# EAGLE design PotBoard (EAGLE 6.2)
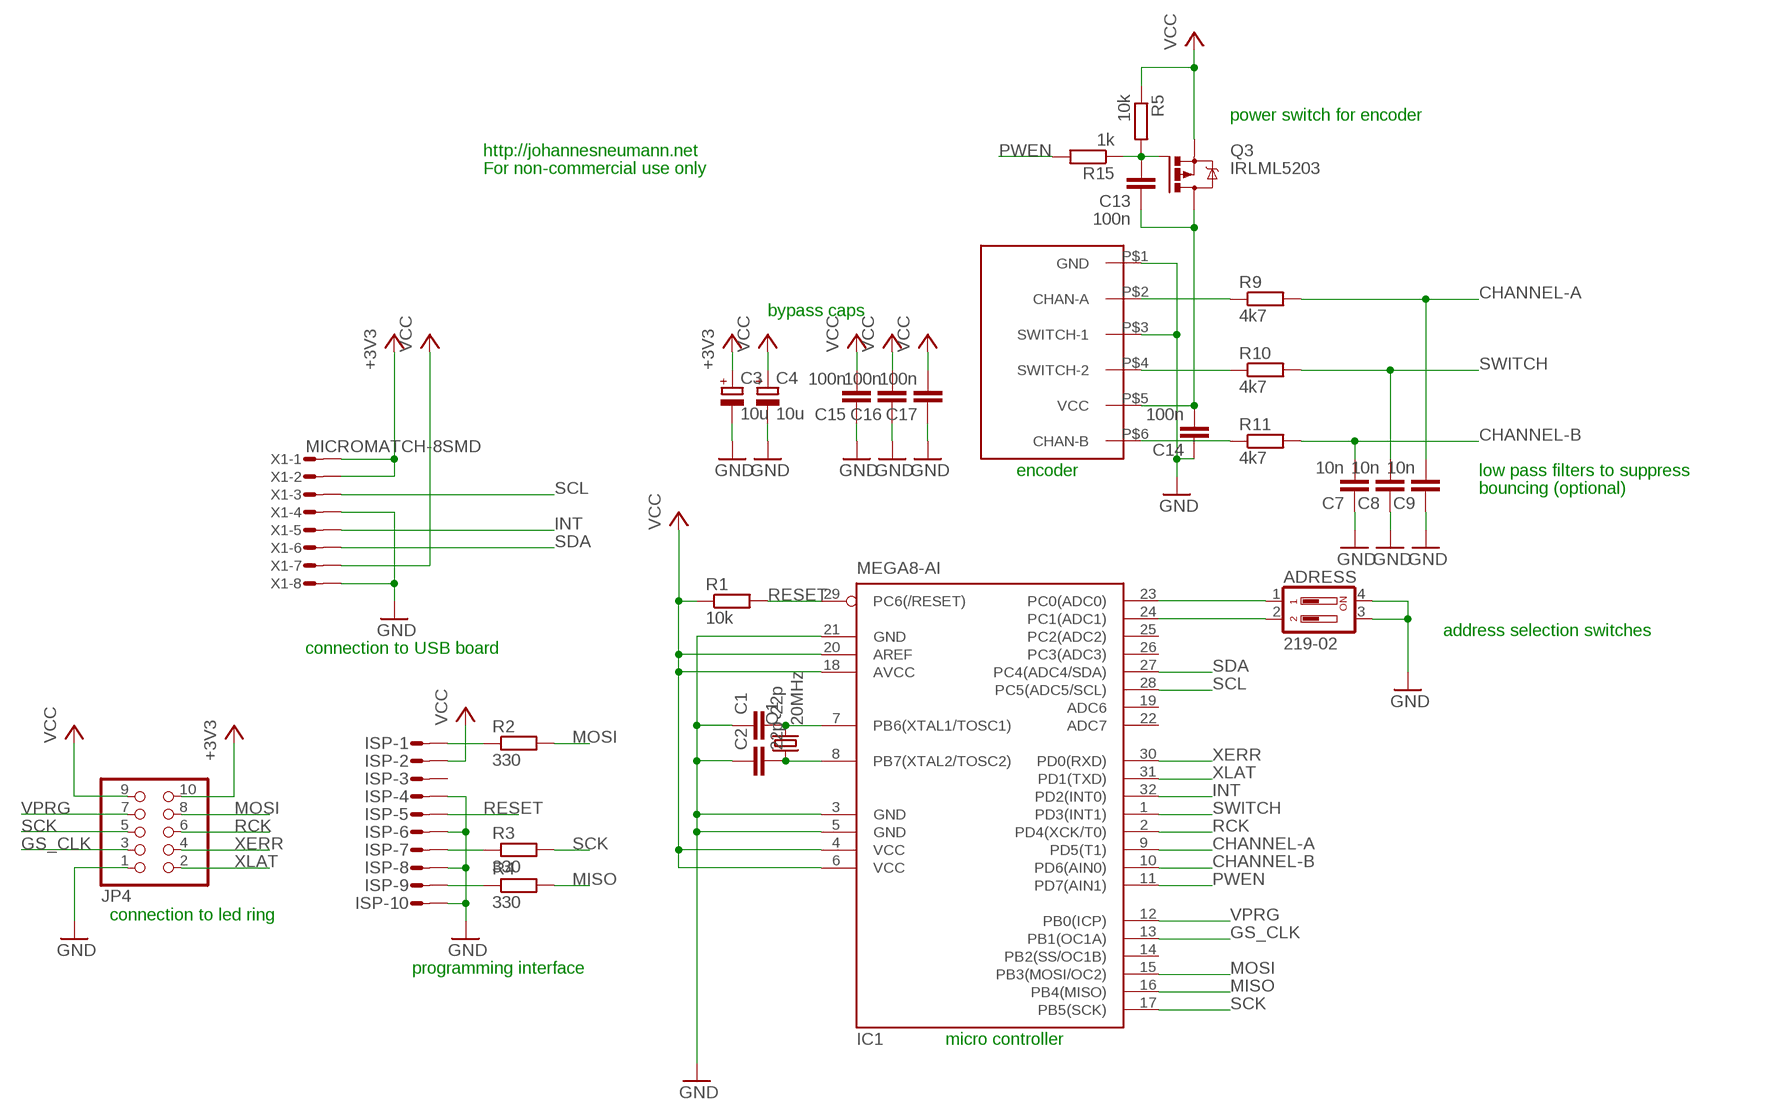
[diagram p0: schematic, sheet 1]

## Parts
ADRESS  219-02  [CTS-219-02]
C1  22p  C-EUC0603  [C0603]
C2  22p  C-EUC0603  [C0603]
C3  10u  CPOL-EU153CLV-0505  [153CLV-0505]
C4  10u  CPOL-EU153CLV-0505  [153CLV-0505]
C7  10n  C-EUC0603  [C0603]
C8  10n  C-EUC0603  [C0603]
C9  10n  C-EUC0603  [C0603]
C13  100n  C-EUC0603  [C0603]
C14  100n  C-EUC0603  [C0603]
C15  100n  C-EUC0603  [C0603]
C16  100n  C-EUC0603  [C0603]
C17  100n  C-EUC0603  [C0603]
IC1  MEGA8-AI  [TQFP32-08]
ISP  MICROMATCH-10-SMD  [MICROMATCH-10-SMD]
JP4  PINHD-2X5_2.54-SMD  [2X05SMD]
Q1  20MHz  CRYSTALSM49  [SM49]
Q3  IRLML5203  [MICRO3]
R1  10k  R-EU_R0603  [R0603]
R2  330  R-EU_R0603  [R0603]
R3  330  R-EU_R0603  [R0603]
R4  330  R-EU_R0603  [R0603]
R5  10k  R-EU_R0603  [R0603]
R9  4k7  R-EU_R0603  [R0603]
R10  4k7  R-EU_R0603  [R0603]
R11  4k7  R-EU_R0603  [R0603]
R15  1k  R-EU_R0603  [R0603]
U$1  BOURNS_EM14  [BOURNS_EM14_AXIAL]
X1  MICROMATCH-8SMD  [MICROMATCH-8-SMD]

## Nets
+3V3: C3.+ JP4.10 X1.1 X1.2
CHANNEL-A: C9.2 IC1.9(PD5(T1)) R9.2
CHANNEL-B: C7.2 IC1.10(PD6(AIN0)) R11.2
GND: ADRESS.3 ADRESS.4 C1.1 C2.1 C3.- C4.- C7.1 C8.1 C9.1 C14.1 C15.1 C16.1 C17.1 IC1.3(GND) IC1.5(GND) IC1.21(GND) ISP.P$4 ISP.P$6 ISP.P$8 ISP.P$10 JP4.1 U$1.P$1(GND) U$1.P$3(SWITCH-1) X1.4 X1.8
GS_CLK: IC1.13(PB1(OC1A)) JP4.3
INT: IC1.32(PD2(INT0)) X1.5
MISO: IC1.16(PB4(MISO)) R4.2
MOSI: IC1.15(PB3(MOSI/OC2)) JP4.8 R2.2
N$1: C1.2 IC1.7(PB6(XTAL1/TOSC1)) Q1.2
N$2: C2.2 IC1.8(PB7(XTAL2/TOSC2)) Q1.1
N$3: ISP.P$1 R2.1
N$4: ISP.P$7 R3.1
N$5: ISP.P$9 R4.1
N$6: ADRESS.1 IC1.23(PC0(ADC0))
N$20: ADRESS.2 IC1.24(PC1(ADC1))
N$26: R11.1 U$1.P$6(CHAN-B)
N$27: R10.1 U$1.P$4(SWITCH-2)
N$28: R9.1 U$1.P$2(CHAN-A)
N$31: C13.2 Q3.1(G) R5.2 R15.1
N$32: C13.1 C14.2 Q3.3(D) U$1.P$5(VCC)
PWEN: IC1.11(PD7(AIN1)) R15.2
RCK: IC1.2(PD4(XCK/T0)) JP4.6
RESET: IC1.29(PC6(/RESET)) ISP.P$5 R1.2
SCK: IC1.17(PB5(SCK)) JP4.5 R3.2
SCL: IC1.28(PC5(ADC5/SCL)) X1.3
SDA: IC1.27(PC4(ADC4/SDA)) X1.6
SWITCH: C8.2 IC1.1(PD3(INT1)) R10.2
VCC: C4.+ C15.2 C16.2 C17.2 IC1.4(VCC) IC1.6(VCC) IC1.18(AVCC) IC1.20(AREF) ISP.P$2 JP4.9 Q3.2(S) R1.1 R5.1 X1.7
VPRG: IC1.12(PB0(ICP)) JP4.7
XERR: IC1.30(PD0(RXD)) JP4.4
XLAT: IC1.31(PD1(TXD)) JP4.2
Unconnected: IC1.14(PB2(SS/OC1B)) IC1.19(ADC6) IC1.22(ADC7) IC1.25(PC2(ADC2)) IC1.26(PC3(ADC3)) ISP.P$3

## Notes on the sheet
- power switch for encoder
- http://johannesneumann.net
- For non-commercial use only
- bypass caps
- encoder | low pass filters to suppress
- bouncing (optional)
- address selection switches
- connection to USB board
- connection to led ring
- programming interface
- micro controller

## Library data of the parts
ADRESS = switch-dil:219-02*: Surface Mount DIP Switch Series 219 SMT CTS Electronic Components Sourc: www.ctscorp.com; OC_FARNELL: unknown; OC_NEWARK: unknown
C1 C2 C7-C9 C13-C17 = rcl:C-EU: CAPACITOR, European symbol
C3 C4 = rcl:CPOL-EU: POLARIZED CAPACITOR, European symbol
IC1 = atmel:MEGA8: MICROCONTROLLER 8 Kbytes FLASH, 1 kbytes SRAM, 512 bytes EEPROM, USART, 6-channel 10 bit ADC, 2-channel 8 bit ADC Pin compatible with Atmega48, ATMega88, ATMega168 Source: avr.lbr
ISP = con-amp-micromatch:MICROMATCH-10-SMD
JP4 = pinhead-2:PINHD-2X5: PIN HEADER
Q1 = crystal:CRYSTAL: CRYSTAL
Q3 = transistor-power:IRLML5203: HEXFET P-Channel Power MOSFET
R1-R5 R9-R11 R15 = rcl:R-EU_: RESISTOR, European symbol
U$1 = bourns_encoder:BOURNS_EM14: Bourns EM14 optical encoder
X1 = con-amp-micromatch-2:MICROMATCH-8: MicroMaTch 8 7-215464-8 / 0-215464-8 Drawing Number C-215464 DDEController.pdf

## Board
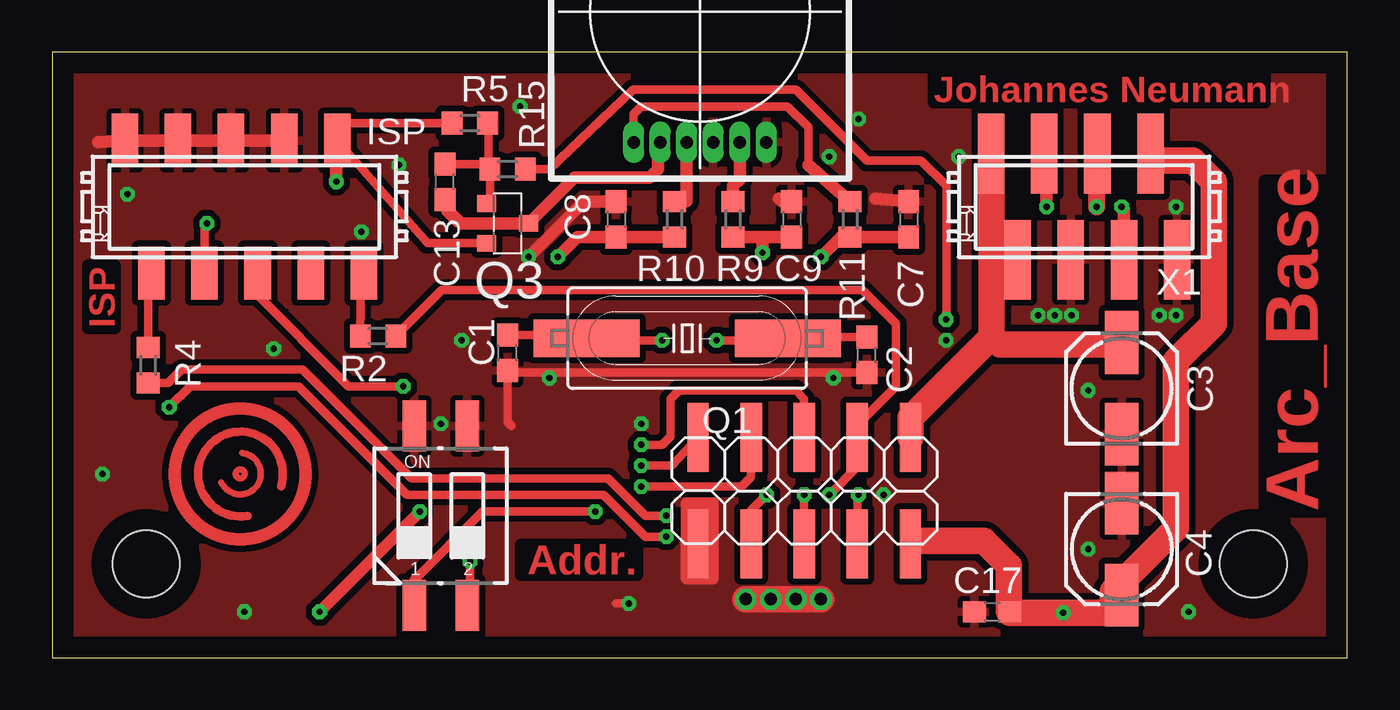
[diagram p1: board, top side]
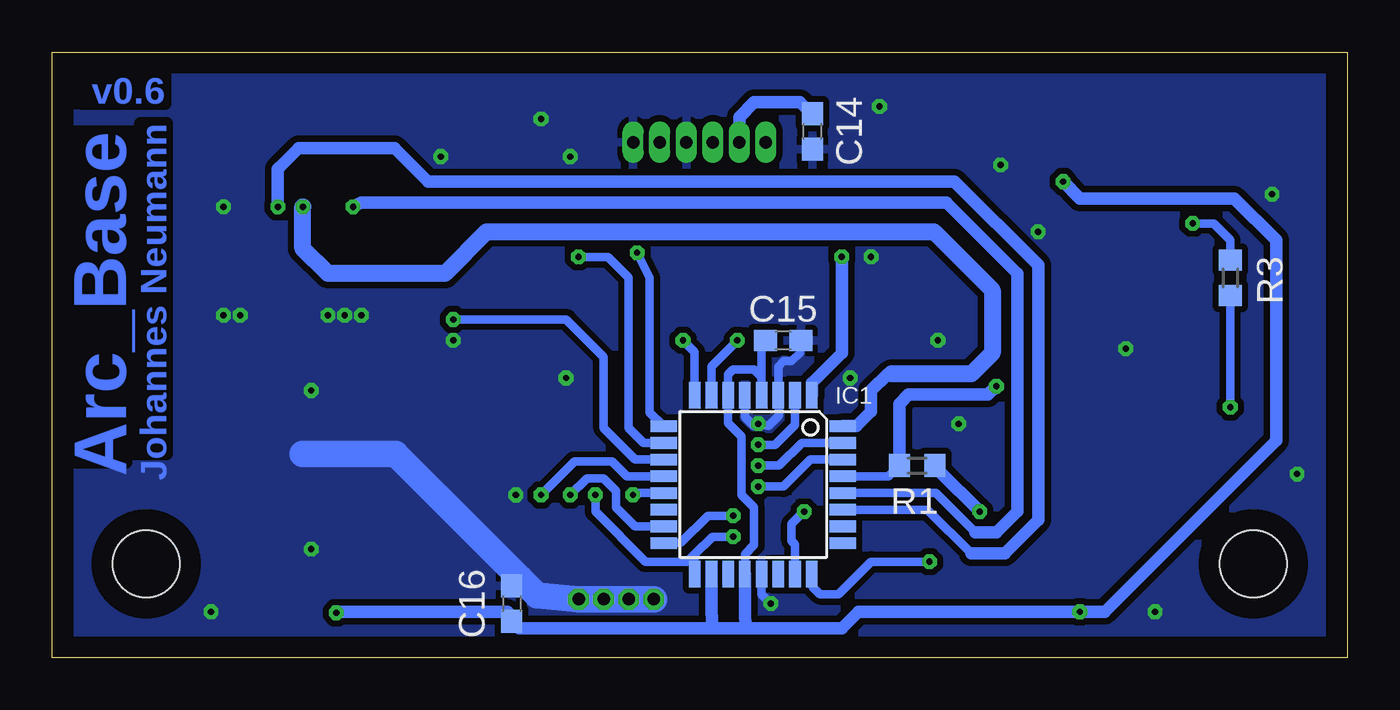
[diagram p2: board, bottom side, seen from below]

Size 62 x 29 mm. Coordinates in mm from the lower left corner, seen from the top.
Outline: 0,0 62,0 62,29 0,29 0,0
Copper layers (1*16): Top 0.035mm / dielectric 1.5mm / Bottom 0.035mm
Design rules "default": minimum track width 0.2mm, minimum drill 0.3mm, track to track 0.2mm, track to pad 0.2mm, pad to pad 0.2mm, via to via 0.2mm, smd to smd 0.15mm, copper to edge 40mil, drill to drill 8mil, minimum pad ring 0.2mm, minimum via ring 0.2mm, stop-mask expansion 0.15mm, vias tented up to drill 0.6mm, thermal gap 10mil
Holes 3.2 mm at 4.5,4.5 57.5,4.5

### Footprints (pad centres in the part's own frame; a part is rotated, then mirrored left to right if it is on the bottom)
CTS-219-02 = smd 1.13 x 2.44: 1 -1.27,-4.3; 2 1.27,-4.3; 3 1.27,4.3; 4 -1.27,4.3
C0603 = smd 1.1 x 1: 1 -0.85,0; 2 0.85,0
153CLV-0505 = smd 3 x 1.6: + 2.2,0; - -2.2,0
TQFP32-08 = smd 1.27 x 0.559: 1 -4.293,2.8; 2 -4.293,2; 3 -4.293,1.2; 4 -4.293,0.4; 5 -4.293,-0.4; 6 -4.293,-1.2; 7 -4.293,-2; 8 -4.293,-2.8; 17 4.293,-2.8; 18 4.293,-2; 19 4.293,-1.2; 20 4.293,-0.4; 21 4.293,0.4; 22 4.293,1.2; 23 4.293,2; 24 4.293,2.8 | smd 0.559 x 1.27: 9 -2.8,-4.293; 10 -2,-4.293; 11 -1.2,-4.293; 12 -0.4,-4.293; 13 0.4,-4.293; 14 1.2,-4.293; 15 2,-4.293; 16 2.8,-4.293; 25 2.8,4.293; 26 2,4.293; 27 1.2,4.293; 28 0.4,4.293; 29 -0.4,4.293; 30 -1.2,4.293; 31 -2,4.293; 32 -2.8,4.293
MICROMATCH-10-SMD = smd 1.27 x 2.54: P$1 -5.715,3.175; P$2 -4.445,-3.175; P$3 -3.175,3.175; P$4 -1.905,-3.175; P$5 -0.635,3.175; P$6 0.635,-3.175; P$7 1.905,3.175; P$8 3.175,-3.175; P$9 4.445,3.175; P$10 5.715,-3.175
2X05SMD = smd 1.016 x 3.302: 1 -5.08,-2.54; 2 -5.08,2.54; 3 -2.54,-2.54; 4 -2.54,2.54; 5 0,-2.54; 6 0,2.54; 7 2.54,-2.54; 8 2.54,2.54; 9 5.08,-2.54; 10 5.08,2.54
SM49 = smd 5.08 x 1.778: 1 -4.826,0; 2 4.826,0
MICRO3 = smd 0.8 x 0.9: 1 -0.95,-1; 2 0.95,-1; 3 0,1
R0603 = smd 1 x 1.1: 1 -0.85,0; 2 0.85,0
BOURNS_EM14_AXIAL = drill 0.6 pad 0.813 long: P$1 3.175,-6.25; P$2 1.905,-6.25; P$3 0.635,-6.25; P$4 -0.635,-6.25; P$5 -1.905,-6.25; P$6 -3.175,-6.25
MICROMATCH-8-SMD = smd 1.27 x 3.81: 1 4.445,-2.54; 2 3.175,2.54; 3 1.905,-2.54; 4 0.635,2.54; 5 -0.635,-2.54; 6 -1.905,2.54; 7 -3.175,-2.54; 8 -4.445,2.54

### Placement (x,y rotation side)
ADRESS  18.6,6.8 0 top
C1  21.8,14.6 90 top
C2  39,14.5 90 top
C3  51.2,12.9 90 top
C4  51.2,5.2 270 top
C7  41,21 270 top
C8  27,21 270 top
C9  35.4,21 270 top
C13  18.8,22.8 90 top
C14  25.6,25.2 90 bottom
C15  27,15.2 180 bottom
C16  40,2.6 270 bottom
C17  45,2.2 0 top
IC1  28.44,8.29 270 bottom
ISP  9.2,21.6 180 top
JP4  36,8 0 top
Q1  30.4,15.3 180 top
Q3  21.8,20.8 270 top
R1  20.6,9.2 180 bottom
R2  15.6,15.4 0 top
R3  5.6,18.2 270 bottom
R4  4.6,14 270 top
R5  20,25.6 0 top
R9  32.6,21 270 top
R10  29.8,21 270 top
R11  38.2,21 270 top
R15  21.8,23.4 0 top
U$1  31.01,30.94 0 top
X1  49.4,21.6 180 top

### Tracks (layer width: path | path; a pad name or v marks a point on that pad's centre or on a via)
+3V3
  Top 0.406: C3.+ 51.25,15.1 51,14.85
  Top 1.27: 44.95,21.6 X1.1 44.95,19.2 | 44.95,19.2 44.95,15.36 | 51,14.85 51.33,14.85 | X1.2 45.09,19.06 44.95,19.2 | JP4.10 41.08,11.48 44.95,15.36 | 44.95,15.36 45.05,15.36 45.4,15 51.1,15 C3.+
CHANNEL-A  (via drill 0.3)
  Top 0.61: R9.2 34,20.15 | 34,20.15 C9.2 | v34,19.4 34,20.15
  Bottom 0.406: v34,19.4 33.4,18.2 33.4,11.76 IC1.9
CHANNEL-B  (via drill 0.3)
  Top 0.61: C7.2 R11.2 37.75,20.15 v36.8,19.2
  Bottom 0.406: v36.8,19.2 35.4,19.2 34.4,18.2 34.4,11 33.69,10.29 IC1.10
GND  (via drill 0.3, 0.6)
  Top 0.406: 22,11.1 21.8,11.3 C1.1 22.1,13.65 C2.1 | v27.6,2.6 27,2.6
  Top 0.61: 34.95,21.85 34.8,22 C9.1 | C7.1 39.4,22 | 2.2,24.69 ISP.P$10 ISP.P$8 ISP.P$6 ISP.P$4 | C8.1 25.45,21.85 v22.8,19.2 | 30.4,4.6 30.4,7.4 31.6,7.4 31.6,3.8 30.4,3.8 30.4,4.6 | JP4.1 30.92,5.12 30.4,4.6
  Top 1.27: v34.4,2.8 v35.6,2.8 v36.8,2.8 v33.2,2.8
  Bottom 0.406: IC1.5 28.84,11.54 28.4,11.1 v28.2,11.2 27.7,11.1 27.2,11.6 27.2,12.54 IC1.3 27.24,13.96 27,14.2 26.6,14.2 26.2,14.6 26.2,15.15 C15.1 | C16.1 39.95,3.45 39.6,3.8 | IC1.21 28.04,3.04 v27.6,2.6
  Bottom 1.27: v33.2,2.8 v34.4,2.8 v35.6,2.8 v36.8,2.8 38.8,3 39.6,3.8 45.57,9.77 50,9.77
  other vias: 18.6,11.2 54.4,2.2 42.8,15.2 37.4,13.4 14.8,20.4 22.4,26.4 3.6,22.2 9.2,2.2 2.4,8.8 39.8,7.8 38.6,25.8 49.6,12.8 49.6,5.2 37.2,24 16.6,23.6 19.6,15.2 23.8,13.4 10.6,14.8 43.4,24 48.8,16.4 53.8,16.4 53.8,21.6 48,16.4 47.2,16.4 53,16.4
  pour Top (isolate 0.305): 0,28.6 62,28.6 62,0 0,0
  pour Bottom (isolate 0.305): 0,28.6 62,28.6 62,0 0,0
GS_CLK  (via drill 0.3)
  Top 0.406: JP4.3 33.46,7.06 v34.2,7.8
  Bottom 0.406: IC1.13 34.11,7.89 v34.2,7.8
INT  (via drill 0.3)
  Top 0.813: v50,21.6 50,24.11 X1.5
  Bottom 0.61: IC1.32 23.51,11.09 22.8,11.8 22.8,12.8 22,13.6 21.8,13.6 19.2,13.6
  Bottom 0.813: 21.8,13.6 18,13.6 17,14.6 17,17.6 19.8,20.4 41.2,20.4 43.2,18.4 48.8,18.4 50,19.6 v50,21.6
MISO  (via drill 0.3)
  Top 0.406: R4.2 5.55,13.15 6.2,13.8 12,13.8 17.2,8.6 26.6,8.6 28.4,6.8 v29.4,6.8
  Bottom 0.406: IC1.16 31.91,5.49 30.6,6.8 v29.4,6.8
MOSI  (via drill 0.3)
  Top 0.406: R2.2 18.65,17.6 38.8,17.6 40.4,16 40.4,13 38.6,11.2 38.6,10.5 JP4.8 38.6,10.38 38.6,9.2 v37.2,7.8
  Bottom 0.406: IC1.15 34.09,6.29 35,7.2 35,8 35.6,8.6 36.4,8.6 v37.2,7.8
N$1  (via drill 0.3)
  Top 0.406: v29.2,15.2 25.67,15.2 25.82,15.45 | C1.2 25.82,15.45 | 25.82,15.45 Q1.2
  Bottom 0.406: IC1.7 30.44,13.96 v29.2,15.2
N$2  (via drill 0.3)
  Top 0.406: v31.8,15.2 35.13,15.2 Q1.1 35.33,15.2 35.8,15.2 35.85,15.35 C2.2
  Bottom 0.406: IC1.8 31.24,14.64 v31.8,15.2
N$3
  Top 0.406: R2.1 14.8,18.31 ISP.P$1
N$4  (via drill 0.3)
  Top 0.406: ISP.P$7 7.29,20.7 v7.4,20.8
  Bottom 0.406: R3.1 5.6,20 6.4,20.8 v7.4,20.8
N$5
  Top 0.406: R4.1 4.6,18.27 ISP.P$9
N$6  (via drill 0.3)
  Top 0.406: v26,7 20.6,7 17.39,3.79 17.33,3.79 ADRESS.1
  Bottom 0.406: IC1.23 26.44,5.44 26.6,5.6 26.6,6.4 v26,7
N$20  (via drill 0.3)
  Top 0.406: v20,4.6 20,2.57 19.87,2.57 ADRESS.2
  Bottom 0.406: IC1.24 25.6,3.4 25.24,3.04 24.36,3.04 22.8,4.6 v20,4.6
N$24
  Top 0.406: 9.35,6.8 arc-297 10.95,8.2
N$25
  Top 0.305: 8.1,8.4 arc239 9.1,9.8
N$26
  Top 0.406: U$1.P$6 27.84,26.04 28.2,26.4 35.2,26.4 36.2,25.4 36.2,23.6
  Top 0.61: 36.2,23.6 R11.1
N$27
  Top 0.61: R10.1 30.38,21.88 U$1.P$4
N$28
  Top 0.61: R9.1 32.6,22.6 32.91,22.91 U$1.P$2
N$31
  Top 0.406: C13.2 20.9,23.65 | 20.9,23.65 R15.1 20.95,21.9 Q3.1 | 20.9,23.65 20.9,25.15 R5.2
N$32
  Top 0.406: Q3.3 19.4,20.8 18.8,21.4 C13.1
  Top 0.61: 18.8,22 18.6,21.8 19.6,20.8 Q3.3 25,23 28.6,23 29,23.4 29,24.59 U$1.P$5
  Bottom 0.61: C14.2 25.65,26.05 26.2,26.6 28.4,26.6 29.11,25.89 U$1.P$5
PWEN  (via drill 0.3)
  Top 0.406: 22.6,23.6 R15.2 23.8,23.4 27.8,27.2 35.6,27.2 39,23.8 41.6,23.8 42.8,22.6 v42.8,16.2
  Bottom 0.406: IC1.11 34.09,9.49 35.6,11 35.6,14.4 37.4,16.2 v42.8,16.2
RCK  (via drill 0.3)
  Top 0.406: v28.2,10.2 29.2,10.2 29.6,10.6 29.6,12.4 30,12.8 35.6,12.8 36,12.4 JP4.6
  Bottom 0.406: IC1.2 26.44,11.16 27.4,10.2 v28.2,10.2
RESET  (via drill 0.3)
  Top 0.406: ISP.P$5 9.8,18.39 9.6,17.6 14.2,13 v16.8,13
  Bottom 0.406: IC1.29 21.96,8.69 R1.2
  Bottom 0.61: 21.54,9.09 R1.2 21.45,12.15 21,12.6 17.2,12.6 v16.8,13
SCK  (via drill 0.3)
  Top 0.406: v5.6,12 6.6,13 11.8,13 17,7.8 26.4,7.8 28.4,5.8 v29.4,5.8 | JP4.5 v36,7.8
  Bottom 0.406: IC1.17 31.24,4.16 | 31.24,4.16 31.2,4.2 | v5.6,12 R3.2 | v29.4,5.8 30.4,5.8 31.24,4.96 | 31.24,4.16 31.24,4.96 | 31.24,4.96 31.6,4.6 33.6,4.6 36,7 v36,7.8
SCL  (via drill 0.3)
  Top 0.61: v47.6,21.6 47.6,24.04 X1.3
  Bottom 0.406: 17.8,6 19.69,7.89 IC1.28
  Bottom 0.61: 17.8,6 16.8,6 15.8,7 15.8,18.4 19.2,21.8 47.2,21.8 v47.6,21.6
SDA  (via drill 0.3)
  Top 0.61: X1.6 51.3,21.5 v51.2,21.6
  Bottom 0.406: IC1.27 20.09,7.09 18,5
  Bottom 0.61: 18,5 16.4,5 14.8,6.6 14.8,18.8 18.8,22.8 44,22.8 45.6,24.4 50.2,24.4 51.1,23.5 51.2,23.4 v51.2,21.6
SWITCH  (via drill 0.3)
  Top 0.61: R10.2 C8.2 25.15,20.15 v24.2,19.2
  Bottom 0.61: v24.2,19.2 24.2,14.6 25.64,13.16 IC1.1
VCC  (via drill 0.3)
  Top 0.406: 50.78,2.13 50.8,2.15 | Q3.2 17.97,19.85 ISP.P$2 13.67,25.6 R5.1 | C4.+ 51.2,2.2 50.05,2.2 50,2.15
  Top 0.61: v13.6,22.8 13.6,24.13 ISP.P$2 | v17.6,7 v12.8,2.2 | v48.4,2.15 50.55,2.15 50.78,3.18 | 41.4,5.4 41.34,5.46 JP4.9 41.22,5.6 41.4,5.6
  Top 1.27: 50.8,2.15 50,2.15 v48.4,2.15 45.85,2.15 C17.2 45.8,2.25 45.8,4.4 44.6,5.6 41.4,5.6 | 50.78,2.13 50.78,3.18 53.8,6.2 53.8,14.2 55.6,16 55.6,22.8 54.6,23.8 52.91,23.8 X1.7
  Bottom 0.406: IC1.4 28.04,13.44 | 28.04,13.44 28.4,13.8 29.4,13.8 29.64,13.56 IC1.6 29.64,11.24 29,10.6 29,7.8 28.4,7.2 28.4,5.4 28.84,4.96 IC1.20 | 28.04,13.44 28.04,15.01 C15.2
  Bottom 0.61: 28.8,1.4 24.2,1.4 23.4,2.2 v12.8,2.2 11.6,2.2 3.4,10.4 3.4,20 5.4,22 12.8,22 v13.6,22.8 | 28.8,1.4 30.4,1.4 | IC1.18 30.44,2.24 30.4,1.4 | IC1.20 28.84,2.24 28.8,1.4 | R1.1 19.55,8.95 v17.6,7 | v48.4,2.15 48.35,2.2 40.2,2.2 40.2,1.95 C16.2 39.65,1.4 30.4,1.4
VPRG  (via drill 0.3)
  Top 0.406: JP4.7 38.54,7.54 v38.6,7.8
  Bottom 0.406: v38.6,7.8 37,9.4 35.2,9.4 34.49,8.69 IC1.12
XERR  (via drill 0.3)
  Top 0.406: v28.2,8.2 33,8.2 33.46,8.66 JP4.4
  Bottom 0.406: IC1.30 25.71,9.49 27,8.2 v28.2,8.2
XLAT  (via drill 0.3)
  Top 0.406: v28.2,9.2 29.68,9.2 JP4.2
  Bottom 0.406: IC1.31 26.11,10.29 27.2,9.2 v28.2,9.2
(copper drawn outside any net)
  shapes: Top circle x2

### Text on the board
Top: Johannes Neumann | ISP | Arc_Base | Addr.
Bottom: v0.6 | Johannes Neumann | Arc_Base